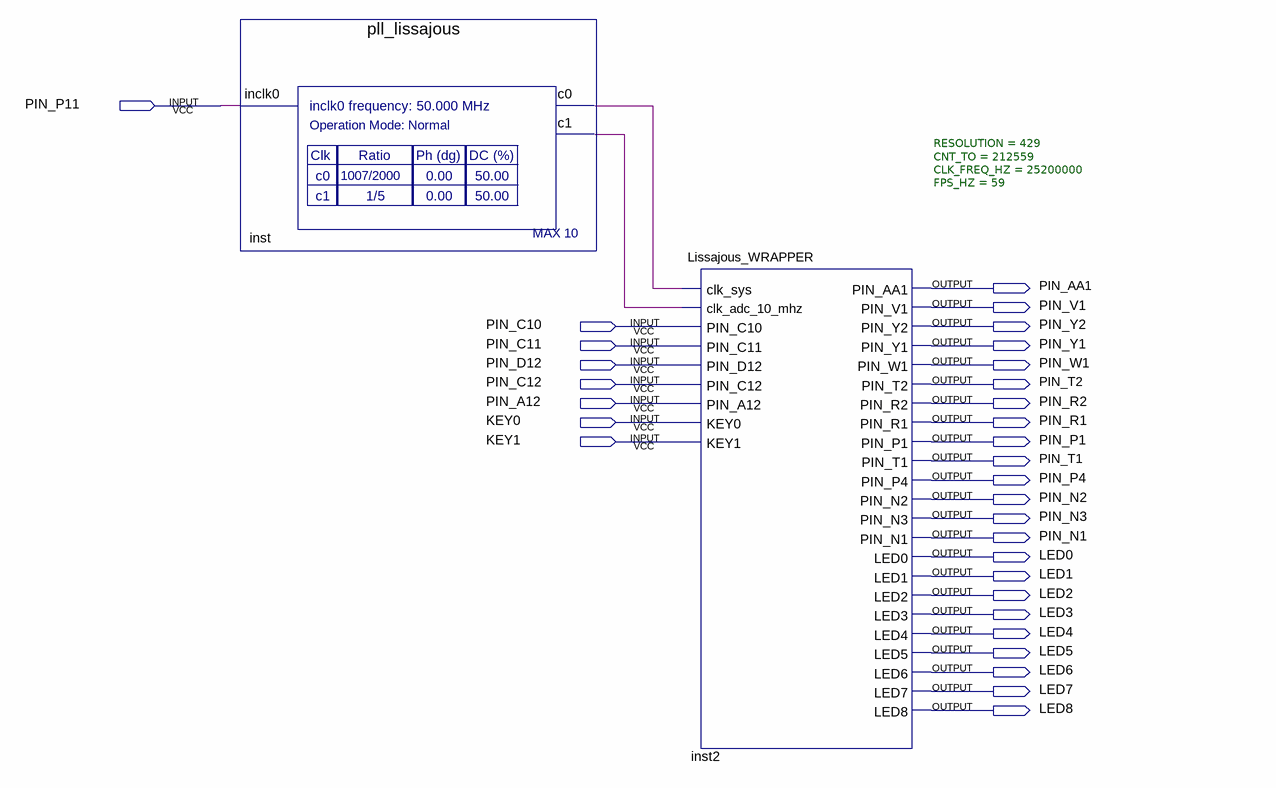
[diagram p0: schematic sheet]
// Quartus schematic Lissajous-curve_top.bdf as structural Verilog: 2 symbols, 31 pins
module \Lissajous-curve_top  (
  input  PIN_P11,
  input  PIN_C10,
  input  PIN_C11,
  input  PIN_D12,
  input  PIN_C12,
  input  PIN_A12,
  input  KEY0,
  input  KEY1,
  output PIN_AA1,
  output PIN_V1,
  output PIN_Y2,
  output PIN_Y1,
  output PIN_W1,
  output PIN_T2,
  output PIN_R2,
  output PIN_R1,
  output PIN_P1,
  output PIN_T1,
  output PIN_P4,
  output PIN_N2,
  output PIN_N3,
  output PIN_N1,
  output LED0,
  output LED1,
  output LED2,
  output LED3,
  output LED4,
  output LED5,
  output LED6,
  output LED7,
  output LED8
);

  wire inst_c0, inst_c1;

  pll_lissajous inst (.inclk0(PIN_P11), .c0(inst_c0), .c1(inst_c1));
  Lissajous_WRAPPER #(.RESOLUTION(429), .CNT_TO(212559), .CLK_FREQ_HZ(25200000), .FPS_HZ(59)) inst2 (
    .clk_sys(inst_c0), .clk_adc_10_mhz(inst_c1), .PIN_C10(PIN_C10), .PIN_C11(PIN_C11), .PIN_D12(PIN_D12),
    .PIN_C12(PIN_C12), .PIN_A12(PIN_A12), .KEY0(KEY0), .KEY1(KEY1), .PIN_AA1(PIN_AA1), .PIN_V1(PIN_V1),
    .PIN_Y2(PIN_Y2), .PIN_Y1(PIN_Y1), .PIN_W1(PIN_W1), .PIN_T2(PIN_T2), .PIN_R2(PIN_R2), .PIN_R1(PIN_R1),
    .PIN_P1(PIN_P1), .PIN_T1(PIN_T1), .PIN_P4(PIN_P4), .PIN_N2(PIN_N2), .PIN_N3(PIN_N3), .PIN_N1(PIN_N1),
    .LED0(LED0), .LED1(LED1), .LED2(LED2), .LED3(LED3), .LED4(LED4), .LED5(LED5), .LED6(LED6), .LED7(LED7),
    .LED8(LED8));
endmodule
